# Altium schematic sheet B293A Monitor.SchDoc: Monitor Circuits
size A4; DocumentNumber: 293; Revision: A
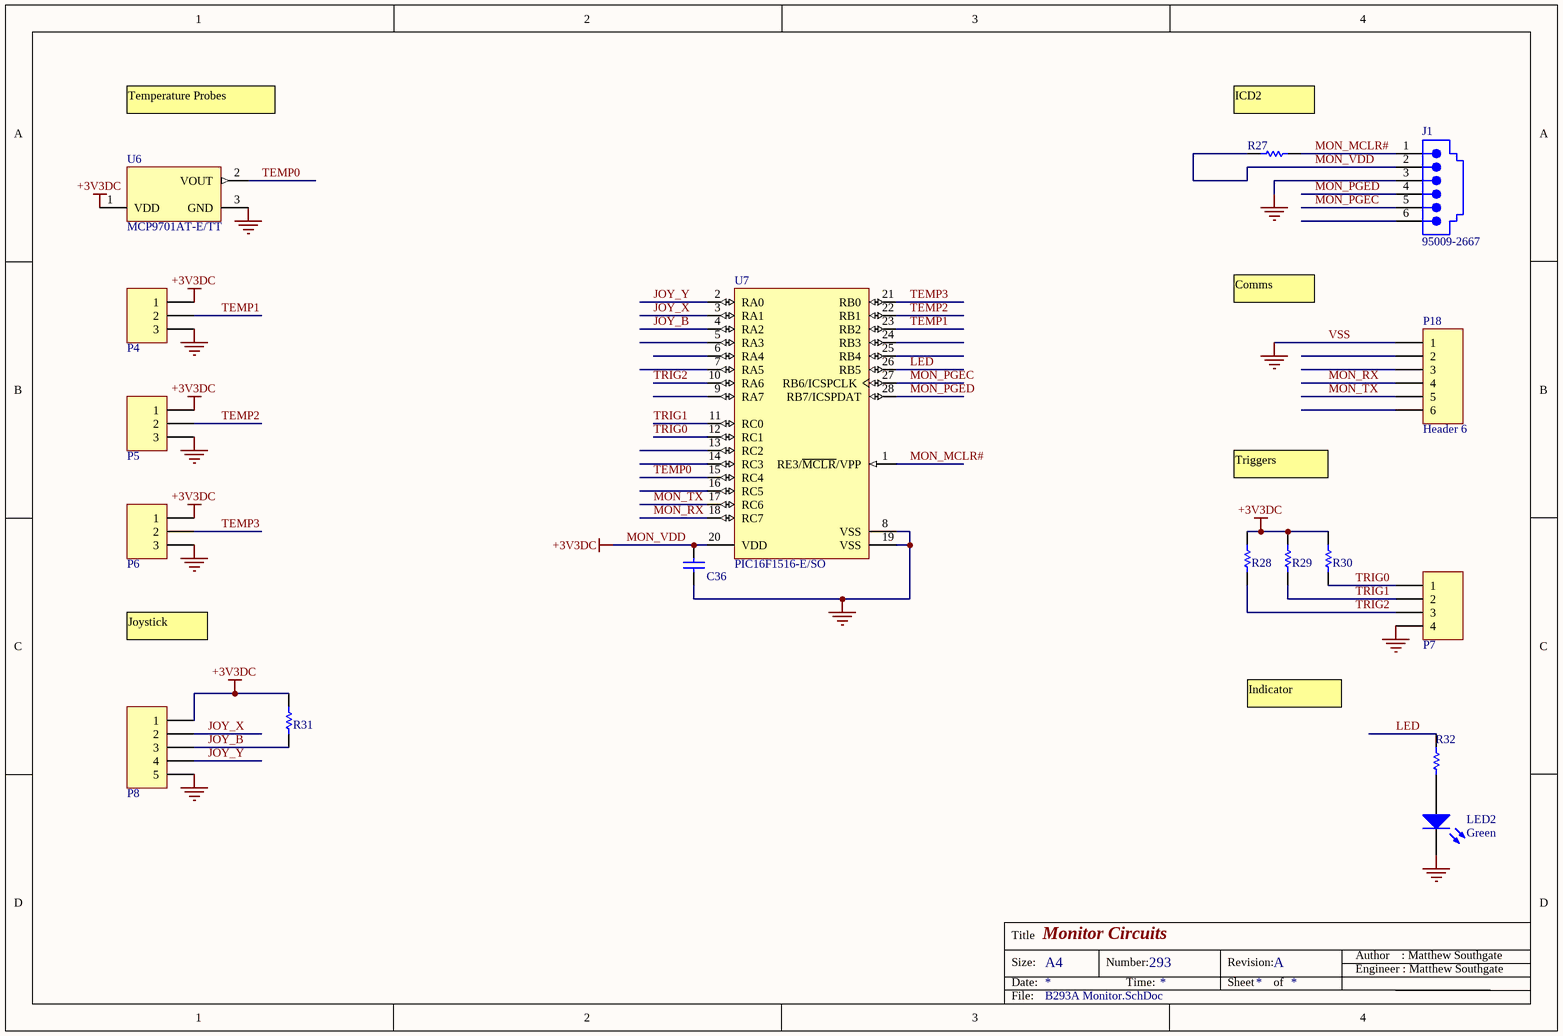
[diagram p0: B293A Monitor.SchDoc]

## Parts
C36  CAP 120nF 50V 0805(2012)  [CAPC0805(2012)145_N]  (value not drawn)
J1  95009-2667  [95009-2667]
LED2  Green  [1206 - LED]
P4  MOLEX SL 3W VERT  [MOLEX SL 3W Vertical with latch]  (value not drawn)
P5  MOLEX SL 3W VERT  [MOLEX SL 3W Vertical with latch]  (value not drawn)
P6  MOLEX SL 3W VERT  [MOLEX SL 3W Vertical with latch]  (value not drawn)
P7  MOLEX SL 4W VERT  [MOLEX SL 4W Vertical with latch]  (value not drawn)
P8  MOLEX SL 5W VERT  [MOLEX SL 5W Vertical with latch]  (value not drawn)
P18  Header 6  [HDR1X6]
R27  10K 5% 0805(2012)  [RESC0805(2012)_L]  (value not drawn)
R28  10K 5% 0805(2012)  [RESC0805(2012)_L]  (value not drawn)
R29  10K 5% 0805(2012)  [RESC0805(2012)_L]  (value not drawn)
R30  10K 5% 0805(2012)  [RESC0805(2012)_L]  (value not drawn)
R31  10K 5% 0805(2012)  [RESC0805(2012)_L]  (value not drawn)
R32  1K 5% 0805(2012)  [RESC0805(2012)_N]  (value not drawn)
U6  MCP9701AT-E/TT  [SOT-23-TT3_M]
U7  PIC16F1516-E/SO  [MCHP-SOIC-SO28_N]

## Nets
MON_VDD: C36.1 J1.2 P4.1 P5.1 P6.1 P8.1 R27.1 R28.2 R29.2 R30.2 R31.2 U6.1(VDD) U7.20(VDD)  [also labelled +3V3DC]
VSS: C36.2 J1.3 LED2.K P4.3 P5.3 P6.3 P7.4 P8.5 P18.1 U6.3(GND) U7.8(VSS) U7.19(VSS)  [also labelled GND]
JOY_B: P8.3 R31.1 U7.4(RA2)
JOY_X: P8.2 U7.3(RA1)
JOY_Y: P8.4 U7.2(RA0)
LED: R32.2 U7.26(RB5)
MON_MCLR#: J1.1 R27.2 U7.1(RE3/~{MCLR}/VPP)
MON_PGEC: J1.5 U7.27(RB6/ICSPCLK)
MON_PGED: J1.4 U7.28(RB7/ICSPDAT)
MON_RX: P18.4 U7.18(RC7)
MON_TX: P18.5 U7.17(RC6)
TEMP0: U6.2(VOUT) U7.15(RC4)
TEMP1: P4.2 U7.23(RB2)
TEMP2: P5.2 U7.22(RB1)
TEMP3: P6.2 U7.21(RB0)
TRIG0: P7.1 R30.1 U7.12(RC1)
TRIG1: P7.2 R29.1 U7.11(RC0)
TRIG2: P7.3 R28.1 U7.10(RA6)
NetLED2_A: LED2.A R32.1

Not connected (* = marked no-connect by the designer): J1 6; P18 2 3 6; U7 5(RA3) 6(RA4) 7(RA5) 9(RA7) 13(RC2) 14(RC3) 16(RC5) 24(RB3) 25(RB4)

## Notes on the sheet
- Temperature Probes
- (near R27) ICD2
- Comms
- Triggers
- Joystick
- Indicator
- Title
- Size:
- Date:
- A4
- Number:
- Time:
- Revision:
- Sheet
- of
- Engineer : Matthew Southgate
- Author    : Matthew Southgate
- File:

## Library data of the parts
C36 = CMP-1036-04456-1: CAP 120nF 50V ±20% 0805 (2012 Metric) Thickness 1.45mm SMD; Case-Metric: 2012; Case-EIA: 0805; Value: 120nF; Max Thickness: 1.45 mm; Rated Voltage: 50 V; Tolerance: ±20%; Technology: SMT
J1 = 95009-2667: Right Angle, Standard Profile, Flush Mount PCB Jack; Manufacturer: MOLEX; Ports: 1; Positions/Loaded: Port1 - 6/6; PerformanceCategory: 3; PCB_Mounting: Thru-Hole; DrillSize: Nominal, Rounded to nearest 0.05mm; PCB_Layout: Complies with Manufacturer's Recommendation.; Description: MOLEX - 95009-2667 - JACK PLUG; Published: 25-Jun-2002; DatasheetDocument: 18-Dec-2001; PackageDocument: 18-Dec-2001; PackageReference: 95009-2667; Publisher: Altium Limited; ComponentLink1Description: Manufacturer Link; ComponentLink1URL: http://www.molex.com/; Supplier 1: Farnell; Supplier Part Number 1: 1393306; Manufacturer Part Number: 95009-2667; RoHS: YES; Stock 1: 159; Pricing 1: 5=0.85, 100=0.52, 250=0.42, 500=0.41, 1000=0.38, 2500=0.34, 2500=0.306, 20000=0.275 (GBP); ComponentLink2URL: http://www.farnell.com/cad/1597831.pdf; ComponentLink2Description: http://www.farnell.com/cad/1597831.pdf; ComponentLink3URL: http://www.farnell.com/datasheets/1627656.pdf; ComponentLink3Description: http://www.farnell.com/datasheets/1627656.pdf; Supplier 2: Newark; Supplier Part Number 2: 60H6049; Stock 2: 0; ComponentLink4URL: http://www.farnell.com/datasheets/1025072.pdf; ComponentLink4Description: http://www.farnell.com/datasheets/1025072.pdf; ComponentLink5URL: http://www.molex.com/pdm_docs/sd/950092667_sd.pdf; ComponentLink5Description: http://www.molex.com/pdm_docs/sd/950092667_sd.pdf
LED2 = LED 1206 GREEN: LED, SMD, 1206, CLR LENS, GREEN; Manufacturer Part Number: KPC-3216SGC; Manufacturer: KINGBRIGHT; Order Code: 1318254; Supplier: Farnell; Supplier 1: Farnell; RoHS: YES; Stock 1: 798; Pricing 1: 10=0.2, 50=0.169, 100=0.146, 250=0.126, 500=0.119, 1000=0.107, 1000=0.0964, 8000=0.0868 (GBP); ComponentLink1URL: http://www.us.kingbright.com/images/catalog/SPEC/APC3216SGC.pdf; ComponentLink1Description: http://www.us.kingbright.com/images/catalog/SPEC/APC3216SGC.pdf; Supplier Part Number 1: 1318254
P4-P6 = MOLEX SL 3W VERT: MOLEX - 70543-0037 - WIRE-BOARD CONNECTOR HEADER 3POS, 2.54MM; Order Code: 1366811; Supplier: Farnell; Manufacturer Part Number: 70543-0037
P7 = MOLEX SL 4W VERT: MOLEX - 70543-0108 - CONNECTOR, HEADER, 4POS, 1ROW, 2.54MM; Order Code: 1508499; Supplier: Farnell; Manufacturer Part Number: 70543-0108
P8 = MOLEX SL 5W VERT: MOLEX - 70543-0004 - CONNECTOR, HEADER, 5POS, 1ROW, 2.54MM; Order Code: 2060692; Supplier: Farnell; Manufacturer Part Number: 70543-0004
P18 = Header 6: Header, 6-Pin; LatestRevisionDate: 17-Jul-2002; LatestRevisionNote: Re-released for DXP Platform.; Publisher: Altium Limited
R27-R31 = CMP-1013-00098-1: 10K 0.125W 5% 0805 (2012 Metric)  SMD; Case-Metric: 2012; Value: 10000.00 Ohm; Case-EIA: 0805; Power: 0.125 W; Technology: SMT; Tolerance: 5 %
R32 = CMP-1013-00074-1: 1K 0.125W 5% 0805 (2012 Metric)  SMD; Case-Metric: 2012; Case-EIA: 0805; Value: 1000.00 Ohm; Tolerance: 5 %; Technology: SMT; Power: 0.125 W
U6 = CMP-0192-00221-1: Low-Power Linear Active Thermistor IC, 3-Pin SOT-23, Extended Temperature, Tape and Reel; PackageDescription: 3-Lead Plastic Small Outline Transistor (TT) [SOT-23]; DatasheetVersion: revE, Apr-2009; Code_IPC: SOT23-3; PackageVersion: revBB, Aug-2009; PackageReference: SOT-23-TT3
U7 = CMP-0115-02502-1: Flash Microcontroller with XLP Technology, 20 MHz, 24 I/O, -40 to 125 degC, 28-pin SOIC (SO28), Tube; Manufacturer: Microchip; Digital Communication: 1 -A/E/USART, 1 -MSSP(SPI/I2C); I/O Pins: 24; # of A/D Channels: 17; Program Memory KWords: 8; RAM: 512; Max. CPU Speed MHz: 20; Program Memory KBytes: 14; Operation Voltage Range: 2.3V - 5.5V; Timers: 2 - 8-bit, 1 - 16-bit; Internal Oscillator: 16 MHz, 32 kHz; Packing: TUBE; ComponentLink2URL: http://www.microchip.com/stellent/groups/techpub_sg/documents/packagingspec/en012702.pdf; ComponentLink2Description: Package Specification; PackageDescription: 28-Lead Plastic Small Outline, 17.9 x 7.5 mm Body, 1.27 mm Pitch; ComponentLink1Description: Datasheet; Mounting Technology: Surface Mount; RoHS: TRUE; ComponentLink1URL: http://ww1.microchip.com/downloads/en/DeviceDoc/41452C.pdf; PackageVersion: C04-052C, 12/2012; Memory Type: Flash; DatasheetVersion: Rev. C; PartNumber: PIC16F1516-E/SO; ComponentLink3URL: Product URL:http://www.microchip.com/datasheet/PIC16F1516; PackageReference: SOIC-SO28; ComponentLink3Description: URL Link1